# Altium schematic sheet Main.SchDoc: Main
size A; DocumentNumber: 1; SheetNumber: 1; SheetTotal: 11
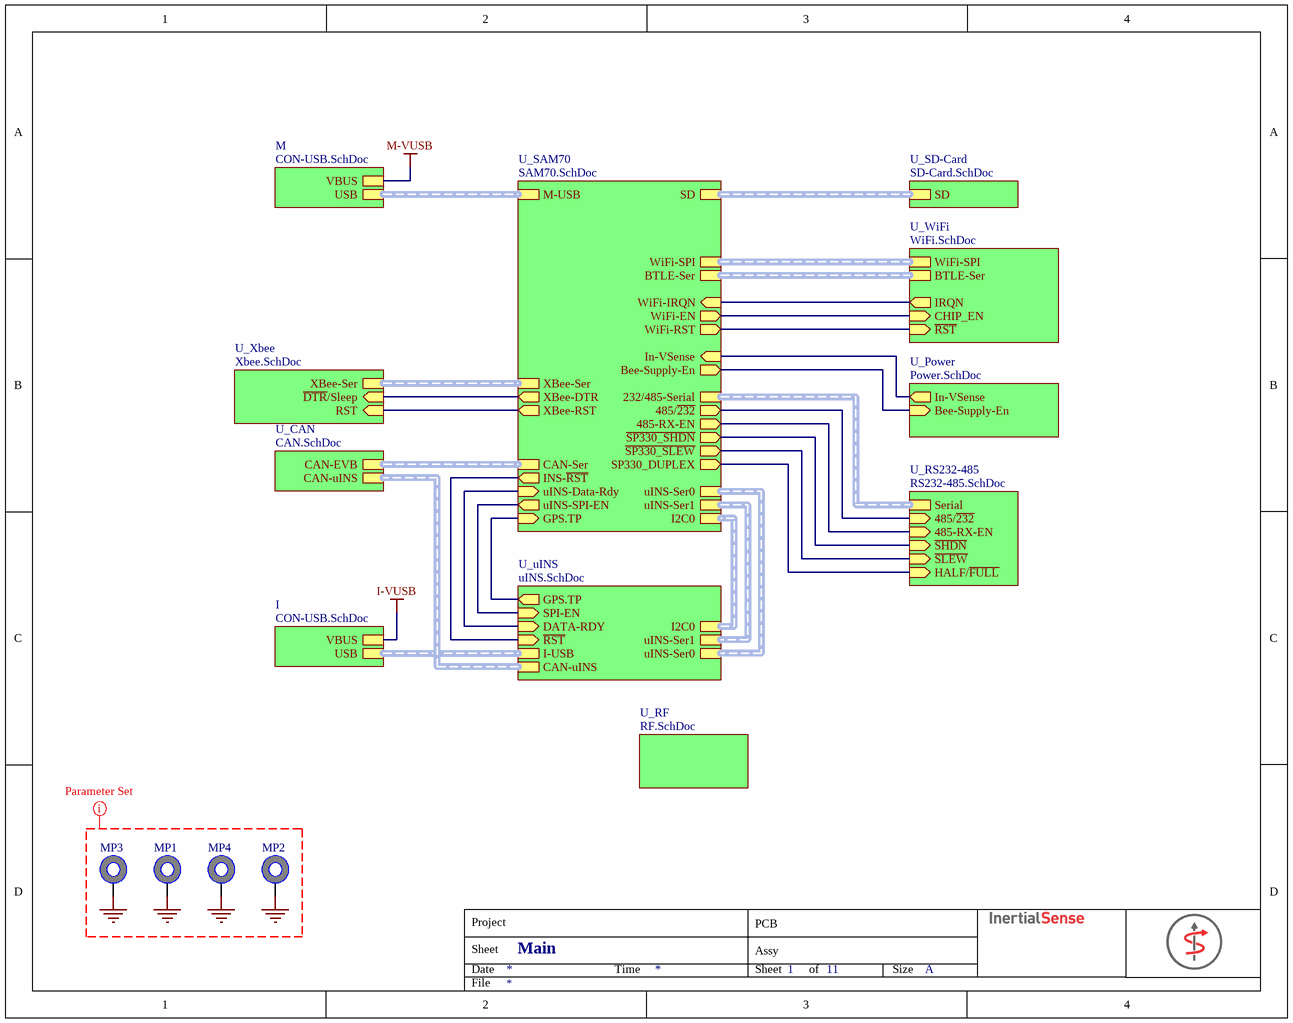
[diagram p0: Main.SchDoc]

## Parts
MP1  Standoff  [9774050151R]  (value not drawn)
MP2  Standoff  [9774050151R]  (value not drawn)
MP3  Standoff  [9774050151R]  (value not drawn)
MP4  Standoff  [9774050151R]  (value not drawn)

## Sub-sheets
I = CON-USB.SchDoc: USB (harness USB), VBUS
M = CON-USB.SchDoc: USB (harness USB), VBUS
U_CAN = CAN.SchDoc: CAN-EVB (harness CAN), CAN-uINS (harness CAN)
U_Power = Power.SchDoc: Bee-Supply-En (in), In-VSense (out)
U_RF = RF.SchDoc: no entries
U_RS232-485 = RS232-485.SchDoc: Serial (harness UART), 485/~{232} (in), 485-RX-EN (in), ~{SHDN} (in), ~{SLEW} (in), HALF/~{FULL} (in)
U_SAM70 = SAM70.SchDoc: M-USB (harness USB), I2C0 (harness I2C), CAN-Ser (harness CAN), uINS-Ser0 (harness UART), XBee-Ser (harness UART), uINS-Ser1 (harness USART), WiFi-SPI (harness SPI), BTLE-Ser (harness UART), SD (harness SDIO), XBee-DTR (out), WiFi-IRQN (in), WiFi-EN (out), WiFi-RST (out), XBee-RST (out), Bee-Supply-En (out), uINS-SPI-EN (out), 485/~{232} (out), uINS-Data-Rdy (in), GPS.TP (in), 232/485-Serial (harness UART), 485-RX-EN (out), ~{SP330_SHDN} (out), ~{SP330_SLEW} (out), SP330_DUPLEX (out), INS-~{RST} (out), In-VSense (in)
U_SD-Card = SD-Card.SchDoc: SD (harness SDIO)
U_uINS = uINS.SchDoc: uINS-Ser0 (harness UART), uINS-Ser1 (harness USART), I-USB (harness USB), I2C0 (harness I2C), ~{RST} (in), SPI-EN (in), DATA-RDY (in), GPS.TP (out), CAN-uINS (harness CAN)
U_WiFi = WiFi.SchDoc: CHIP_EN (in), WiFi-SPI (harness SPI), BTLE-Ser (harness UART), ~{RST} (in), IRQN (out)
U_Xbee = Xbee.SchDoc: RST (in), XBee-Ser (harness UART), ~{DTR}/Sleep (in)

## Nets
GND: MP1.1 MP2.1 MP3.1 MP4.1
I-VUSB: sheet I/VBUS
M-VUSB: sheet M/VBUS
(unnamed): sheet U_Power/Bee-Supply-En, sheet U_SAM70/Bee-Supply-En
(unnamed): sheet U_Power/In-VSense, sheet U_SAM70/In-VSense
(unnamed): sheet U_RS232-485/485/~{232}, sheet U_SAM70/485/~{232}
(unnamed): sheet U_RS232-485/485-RX-EN, sheet U_SAM70/485-RX-EN
(unnamed): sheet U_RS232-485/~{SHDN}, sheet U_SAM70/~{SP330_SHDN}
(unnamed): sheet U_RS232-485/~{SLEW}, sheet U_SAM70/~{SP330_SLEW}
(unnamed): sheet U_RS232-485/HALF/~{FULL}, sheet U_SAM70/SP330_DUPLEX
(unnamed): sheet U_SAM70/XBee-DTR, sheet U_Xbee/~{DTR}/Sleep
(unnamed): sheet U_SAM70/WiFi-IRQN, sheet U_WiFi/IRQN
(unnamed): sheet U_SAM70/WiFi-EN, sheet U_WiFi/CHIP_EN
(unnamed): sheet U_SAM70/WiFi-RST, sheet U_WiFi/~{RST}
(unnamed): sheet U_SAM70/XBee-RST, sheet U_Xbee/RST
(unnamed): sheet U_SAM70/uINS-SPI-EN, sheet U_uINS/SPI-EN
(unnamed): sheet U_SAM70/uINS-Data-Rdy, sheet U_uINS/DATA-RDY
(unnamed): sheet U_SAM70/GPS.TP, sheet U_uINS/GPS.TP
(unnamed): sheet U_SAM70/INS-~{RST}, sheet U_uINS/~{RST}

## Buses and harness runs
harness sheet I/USB = sheet U_uINS/I-USB
harness sheet M/USB = sheet U_SAM70/M-USB
harness sheet U_CAN/CAN-EVB = sheet U_SAM70/CAN-Ser
harness sheet U_CAN/CAN-uINS = sheet U_uINS/CAN-uINS
harness sheet U_RS232-485/Serial = sheet U_SAM70/232/485-Serial
harness sheet U_SAM70/BTLE-Ser = sheet U_WiFi/BTLE-Ser
harness sheet U_SAM70/I2C0 = sheet U_uINS/I2C0
harness sheet U_SAM70/SD = sheet U_SD-Card/SD
harness sheet U_SAM70/uINS-Ser0 = sheet U_uINS/uINS-Ser0
harness sheet U_SAM70/uINS-Ser1 = sheet U_uINS/uINS-Ser1
harness sheet U_SAM70/WiFi-SPI = sheet U_WiFi/WiFi-SPI
harness sheet U_SAM70/XBee-Ser = sheet U_Xbee/XBee-Ser

## Layout directives
net class Mounting Holes: GND

## Notes on the sheet
- Date
- Sheet
- Project
- Time
- PCB
- Assy
- of
- Size
- A
- File

## Library data of the parts
MP1-MP4 = Standoff: RND STANDOFF M2.5X0.45 STEEL 5MM; Manufacturer: Wurth Electronics; Manufacturer Part Number: 9774050951R; Plating: Tin; Threaded/Unthreaded: Unthreaded; Inside Diameter: 0.106inch; Outside Diameter: 0.201inch; Supplier 1: Digi-Key; Supplier Part Number 1: 732-7098-1-ND; Stock 1: 2378; Pricing 1: 1=0.95, 10=0.918, 50=0.795, 100=0.739 (USD); Material: Steel; Length: 0.252inch; REACH SVHC: Unknown